# EAGLE design Schematix (EAGLE 9.6.2)
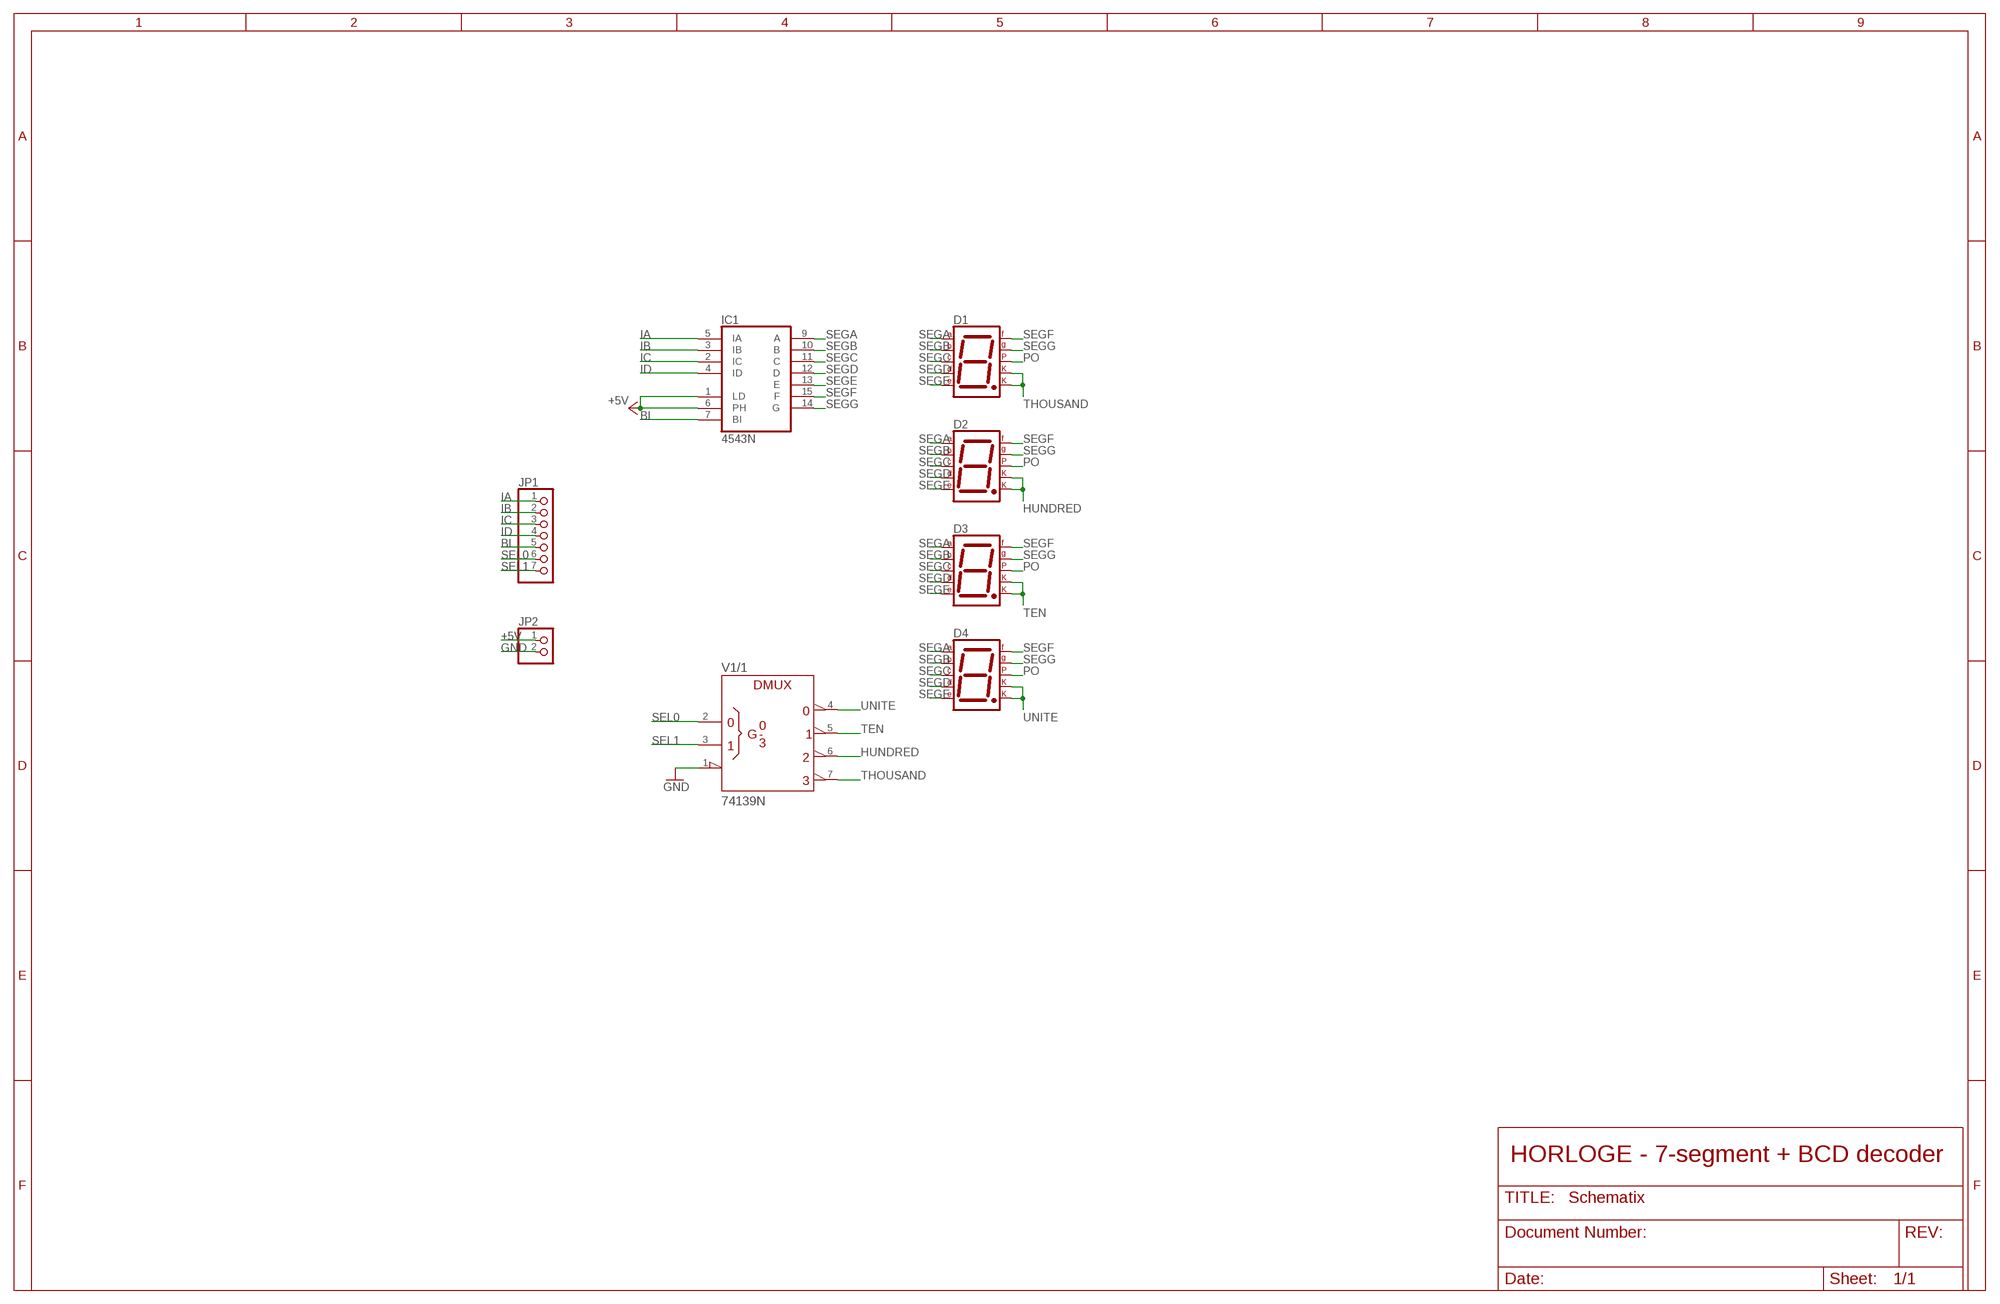
[diagram p0: schematic, sheet 1]

## Parts
D1  7SEG-CK  [7SEG-13]
D2  7SEG-CK  [7SEG-13]
D3  7SEG-CK  [7SEG-13]
D4  7SEG-CK  [7SEG-13]
IC1  4543N  [DIL16]
JP1  PINHD-1X7/90  [1X07/90]
JP2  PINHD-1X2/90  [1X02/90]
V1  74139N  [DIL16]

## Nets
+5V: IC1.1(LD) IC1.6(PH) JP2.1
BI: IC1.7(BI) JP1.5
GND: JP2.2 V1.1(/1:!G)
HUNDRED: D2.3(CK1) D2.8(CK2) V1.6(/1:Y2)
IA: IC1.5(IA) JP1.1
IB: IC1.3(IB) JP1.2
IC: IC1.2(IC) JP1.3
ID: IC1.4(ID) JP1.4
PO: D1.5(DP) D2.5(DP) D3.5(DP) D4.5(DP)
SEGA: D1.7(A) D2.7(A) D3.7(A) D4.7(A) IC1.9(A)
SEGB: D1.6(B) D2.6(B) D3.6(B) D4.6(B) IC1.10(B)
SEGC: D1.4(C) D2.4(C) D3.4(C) D4.4(C) IC1.11(C)
SEGD: D1.2(D) D2.2(D) D3.2(D) D4.2(D) IC1.12(D)
SEGE: D1.1(E) D2.1(E) D3.1(E) D4.1(E) IC1.13(E)
SEGF: D1.9(F) D2.9(F) D3.9(F) D4.9(F) IC1.15(F)
SEGG: D1.10(G) D2.10(G) D3.10(G) D4.10(G) IC1.14(G)
SEL0: JP1.6 V1.2(/1:A)
SEL1: JP1.7 V1.3(/1:B)
TEN: D3.3(CK1) D3.8(CK2) V1.5(/1:Y1)
THOUSAND: D1.3(CK1) D1.8(CK2) V1.7(/1:Y3)
UNITE: D4.3(CK1) D4.8(CK2) V1.4(/1:Y0)
Unconnected: V1.9(/2:Y3) V1.10(/2:Y2) V1.11(/2:Y1) V1.12(/2:Y0) V1.13(/2:B) V1.14(/2:A) V1.15(/2:!G)

## Notes on the sheet
- HORLOGE - 7-segment + BCD decoder

## Power pins joined to a net without a drawn wire
+UB: V1.16(/+UB:+UB)
-UB: V1.8(/-UB:-UB)
VDD: IC1.16(VDD)
VSS: IC1.8(VSS)

## Library data of the parts
D1-D4 = special:7SEG-CK: 7-segment DISPLAY single cathode, 13 mm
IC1 = 45xx:4543: BCD to 7-segment LCD DECODER
JP1 = pinhead:PINHD-1X7: PIN HEADER
JP2 = pinhead:PINHD-1X2: PIN HEADER
V1 = 74ttl-din:74*139: Dual 2-line to 4-line DECODER/DEMULTIPLEXER

## Board
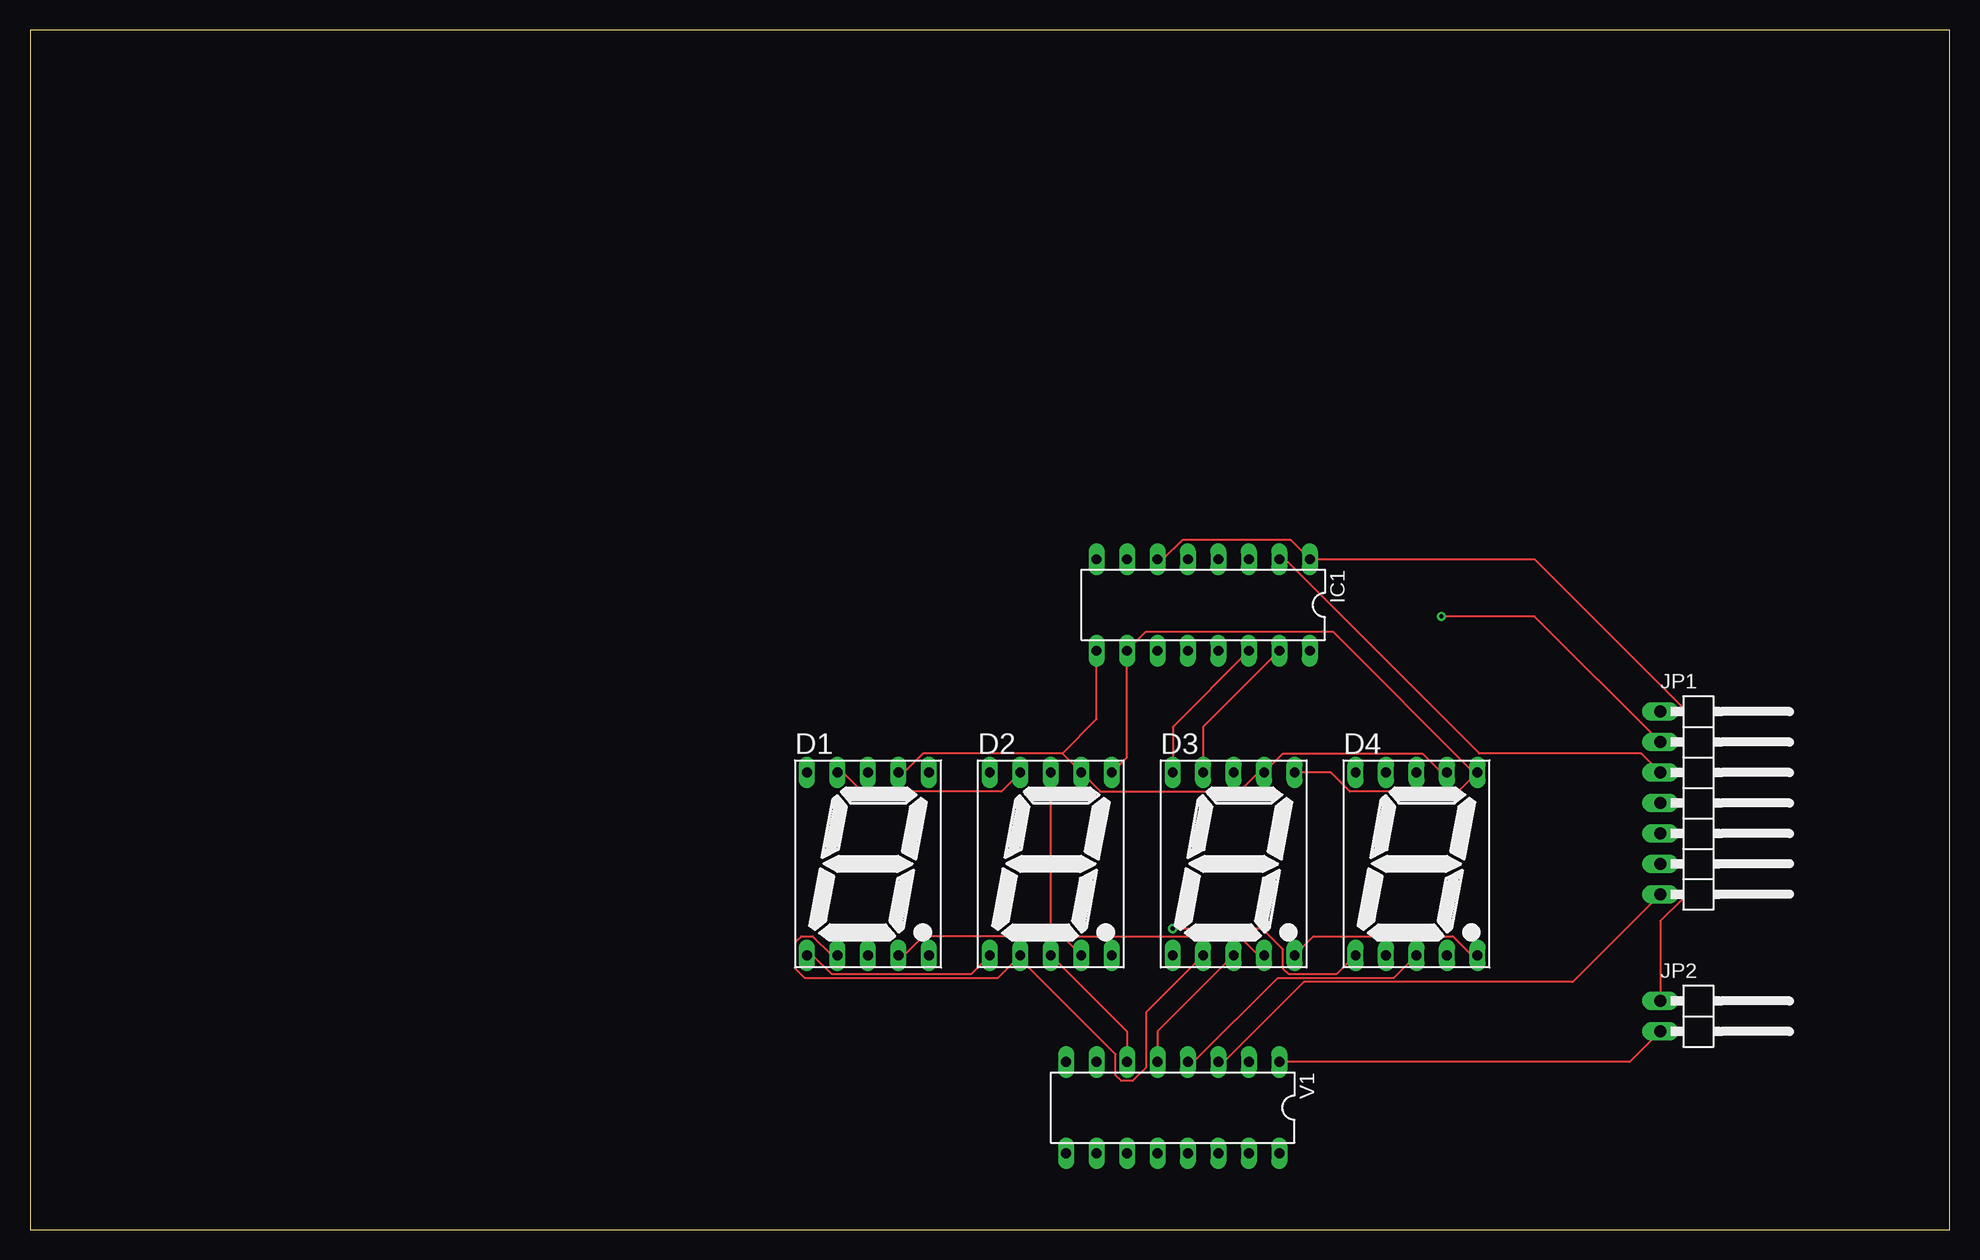
[diagram p1: board, top side]
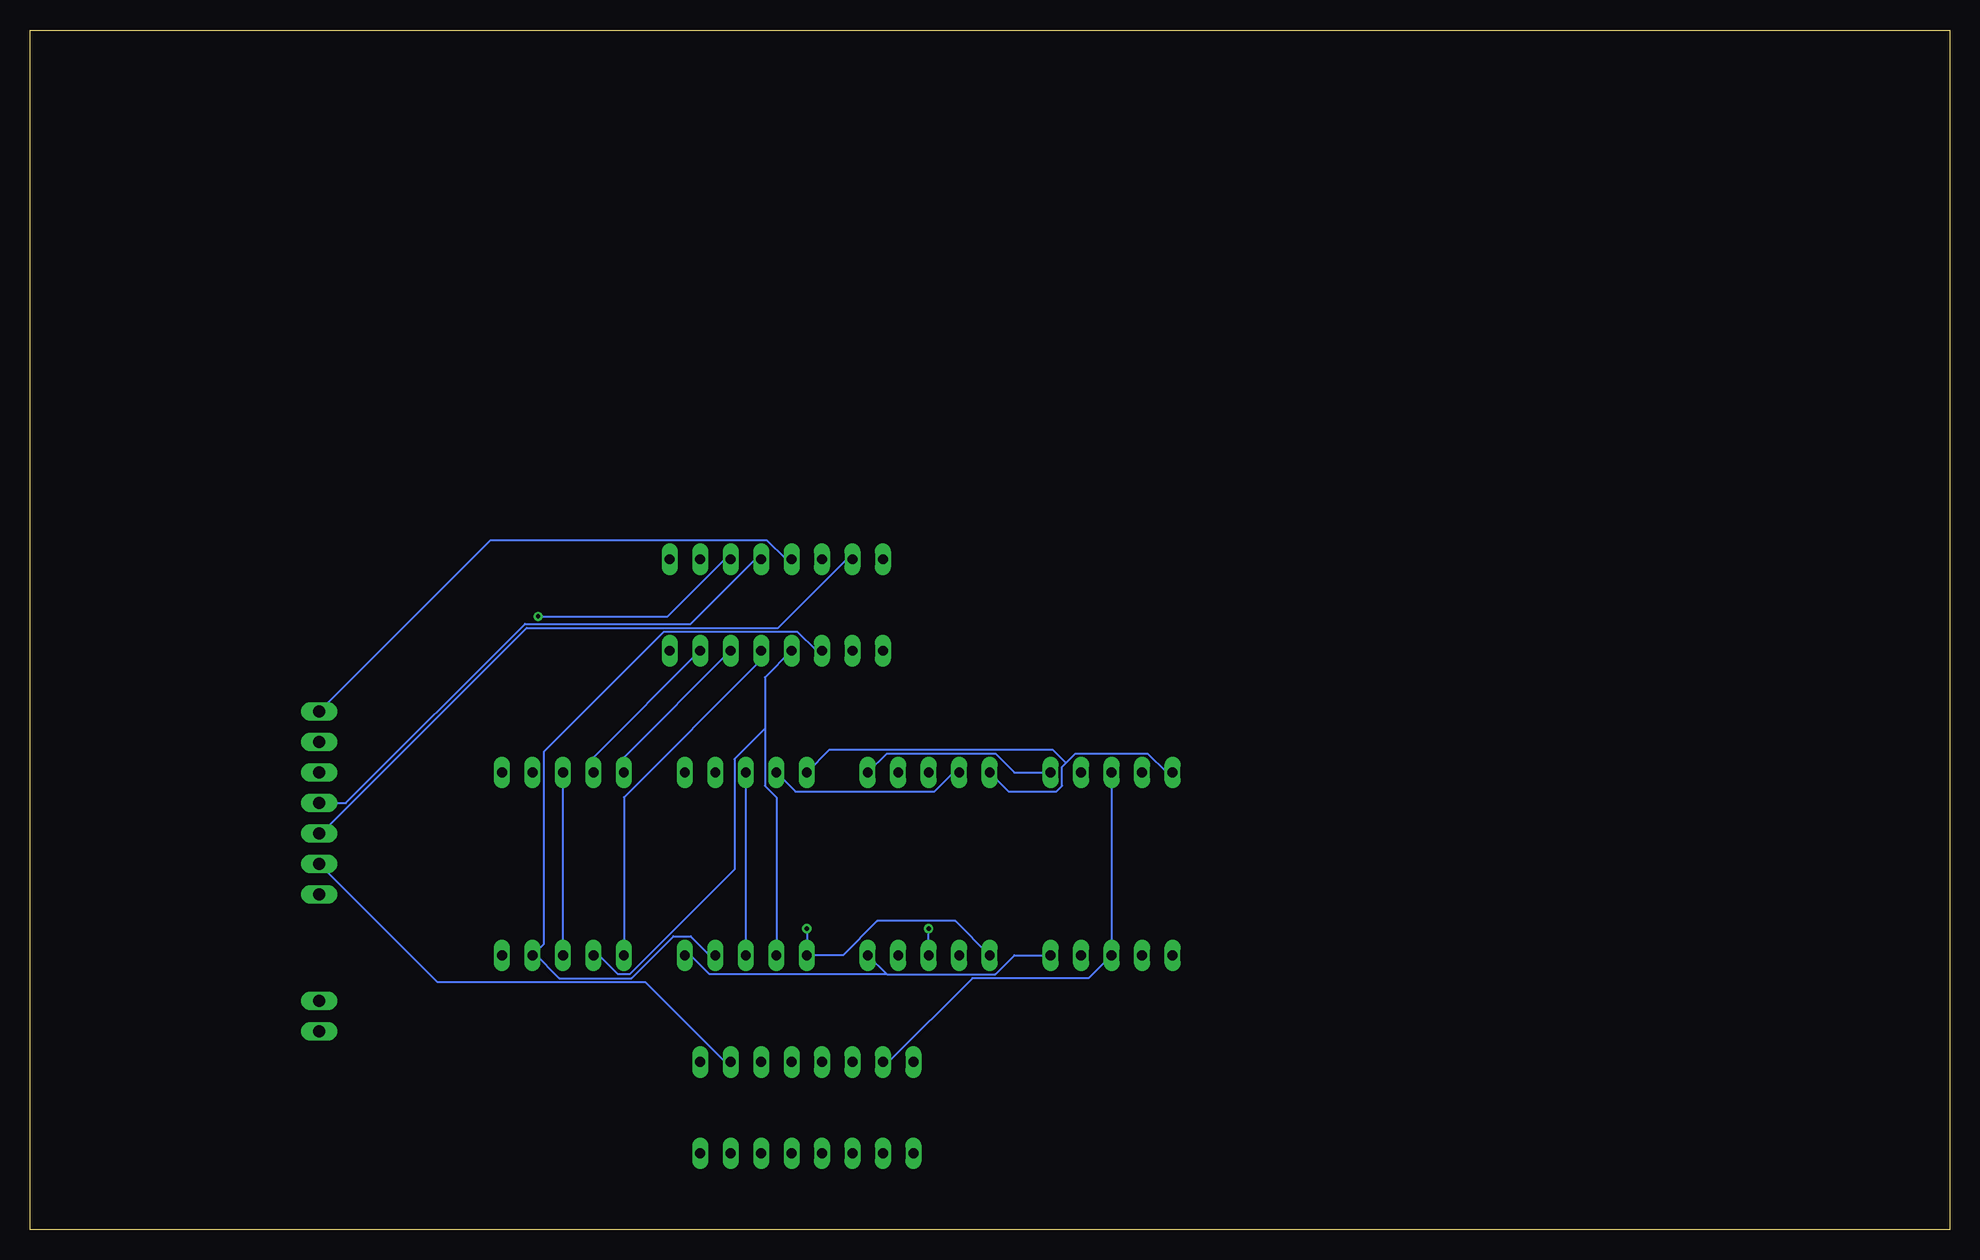
[diagram p2: board, bottom side, seen from below]

Size 160 x 100 mm. Coordinates in mm from the lower left corner, seen from the top.
Outline: 0,0 160,0 160,100 0,100 0,0
Copper layers (1*16): Top 0.035mm / dielectric 1.5mm / Bottom 0.035mm
Design rules "default": minimum track width 6mil, minimum drill 0.35mm, track to track 6mil, track to pad 6mil, pad to pad 6mil, via to via 6mil, smd to smd 6mil, copper to edge 40mil, drill to drill 6mil, minimum pad ring 10mil, minimum via ring 8mil, stop-mask expansion 4mil, vias tented up to drill 0mil, thermal gap 10mil

### Footprints (pad centres in the part's own frame; a part is rotated, then mirrored left to right if it is on the bottom)
7SEG-13 = drill 0.813 long: 1 -5.08,-7.62; 2 -2.54,-7.62; 3 0,-7.62; 4 2.54,-7.62; 5 5.08,-7.62; 6 5.08,7.62; 7 2.54,7.62; 8 0,7.62; 9 -2.54,7.62; 10 -5.08,7.62
DIL16 = drill 0.813 long: 1 -8.89,-3.81; 2 -6.35,-3.81; 3 -3.81,-3.81; 4 -1.27,-3.81; 5 1.27,-3.81; 6 3.81,-3.81; 7 6.35,-3.81; 8 8.89,-3.81; 9 8.89,3.81; 10 6.35,3.81; 11 3.81,3.81; 12 1.27,3.81; 13 -1.27,3.81; 14 -3.81,3.81; 15 -6.35,3.81; 16 -8.89,3.81
1X07/90 = drill 1.016 long: 1 -7.62,-3.81; 2 -5.08,-3.81; 3 -2.54,-3.81; 4 0,-3.81; 5 2.54,-3.81; 6 5.08,-3.81; 7 7.62,-3.81
1X02/90 = drill 1.016 long: 1 -1.27,-3.81; 2 1.27,-3.81

### Placement (x,y rotation side)
D1  69.85,30.48 0 top
D2  85.09,30.48 0 top
D3  100.33,30.48 0 top
D4  115.57,30.48 0 top
IC1  97.79,52.07 180 top
JP1  139.7,35.56 270 top
JP2  139.7,17.78 270 top
V1  95.25,10.16 180 top

### Tracks (layer width: path | path; a pad name or v marks a point on that pad's centre or on a via)
+5V
  Top 0.152: IC1.6 94.46,55.88 96.04,57.47 105.09,57.47 IC1.1 125.41,55.88 137.79,43.5 137.79,27.62 135.89,25.72 JP2.1
BI
  Bottom 0.152: IC1.7 91.92,55.88 97.63,50.16 118.59,50.16 135.73,33.02 JP1.5
GND
  Top 0.152: V1.1 133.35,13.97 JP2.2
HUNDRED  (via drill 0.35)
  Top 0.152: V1.6 91.44,16.51 D2.3 | v85.09,25.08 D2.8
  Bottom 0.152: D2.3 v85.09,25.08
IA
  Bottom 0.152: IC1.5 97,55.88 98.58,57.47 121.6,57.47 JP1.1
IB  (via drill 0.35)
  Top 0.152: v117.63,51.12 125.41,51.12 JP1.2
  Bottom 0.152: IC1.3 102.08,55.88 106.84,51.12 v117.63,51.12
IC
  Top 0.152: IC1.2 104.62,55.88 120.81,39.69 134.3,39.69 JP1.3
ID
  Bottom 0.152: IC1.4 99.54,55.88 104.93,50.48 118.75,50.48 133.67,35.56 JP1.4
PO
  Top 0.152: D4.5 120.17,22.86 118.59,24.45 107,24.45 D3.5
  Bottom 0.152: D1.5 77.95,22.86 79.53,21.27 88.58,21.27 | D2.5 88.58,21.27 | D3.5 104.93,22.86 103.35,21.27 88.58,21.27
SEGA
  Top 0.152: D1.7 72.87,38.1 74.45,39.69 86.04,39.69 | 86.04,39.69 D2.7 89.22,36.51 100.81,36.51 102.39,38.1 D3.7 104.46,39.69 116.05,39.69 117.63,38.1 D4.7 | IC1.9 88.9,42.55 86.04,39.69
SEGB
  Top 0.152: D3.6 108.43,38.1 110.01,36.51 119.06,36.51 120.49,37.94 | D2.6 91.44,39.37 IC1.10 93.03,49.85 108.58,49.85 120.49,37.94 | 120.49,37.94 D4.6
  Bottom 0.152: D1.6 77.95,38.1 79.53,39.69 88.58,39.69 D2.6
SEGC
  Top 0.152: D1.4 72.87,22.86 74.45,24.45 86.04,24.45 | D2.4 86.04,24.45 | D3.4 102.39,22.86 100.81,24.45 86.04,24.45
  Bottom 0.152: IC1.11 94.46,48.26 96.04,49.85 107.16,49.85 117.16,39.85 117.16,23.81 117.95,23.02 | D3.4 103.35,22.86 104.93,24.45 106.36,24.45 109.86,20.95 115.89,20.95 117.95,23.02 | 117.95,23.02 D4.4
SEGD
  Top 0.152: D1.2 66.83,22.86 65.25,24.45 64.29,24.45 63.82,23.97 63.82,21.75 64.61,20.95 80.64,20.95 82.39,22.7 | 82.39,22.7 90.49,14.61 90.49,12.86 90.96,12.38 91.92,12.38 93.03,13.49 93.03,18.1 D3.2 | 82.39,22.7 D2.2
  Bottom 0.152: D3.2 97.79,36.04 98.74,36.99 98.74,41.75 | 98.74,41.75 98.74,46.04 IC1.12 | D4.2 112.55,22.86 110.97,21.27 110.01,21.27 101.28,30 101.28,39.21 98.74,41.75
SEGE  (via drill 0.35)
  Top 0.152: D1.1 65.25,22.86 66.83,21.27 78.42,21.27 D2.1 | v95.25,25.08 102.71,25.08 104.46,23.34 104.46,21.75 104.93,21.27 108.9,21.27 D4.1
  Bottom 0.152: D2.1 82.87,25.72 89.38,25.72 92.23,22.86 D3.1 v95.25,25.08 | D4.1 110.49,36.04 99.06,47.47 IC1.13
SEGF
  Top 0.152: D1.9 67.79,38.1 69.37,36.51 80.96,36.51 D2.9 | D3.9 97.79,41.91 IC1.15
  Bottom 0.152: D4.9 113.03,39.37 IC1.15 | D2.9 83.03,38.1 84.61,36.51 96.2,36.51 D3.9
SEGG
  Top 0.152: D3.10 95.25,41.91 IC1.14
  Bottom 0.152: D1.10 65.25,38.1 66.83,39.69 72.87,39.69 73.66,38.89 | 73.66,38.89 73.98,38.58 73.98,36.99 74.45,36.51 78.42,36.51 D2.10 | D4.10 110.49,39.37 IC1.14 | 73.66,38.89 74.77,40.01 93.34,40.01 D3.10
SEL0
  Bottom 0.152: V1.2 102.08,13.97 108.74,20.64 126.05,20.64 JP1.6
SEL1
  Top 0.152: V1.3 99.54,13.97 106.2,20.64 128.59,20.64 JP1.7
TEN
  Top 0.152: V1.5 93.98,16.51 D3.3
  Bottom 0.152: D3.3 D3.8
THOUSAND
  Bottom 0.152: D1.8 D1.3 71.75,20.95 81.44,20.95 88.42,13.97 V1.7
UNITE
  Top 0.152: V1.4 97,13.97 103.98,20.95 113.67,20.95 D4.3
  Bottom 0.152: D4.3 D4.8